# Altium schematic sheet LED.SchDoc
size A4; SheetNumber: 1; SheetTotal: 1
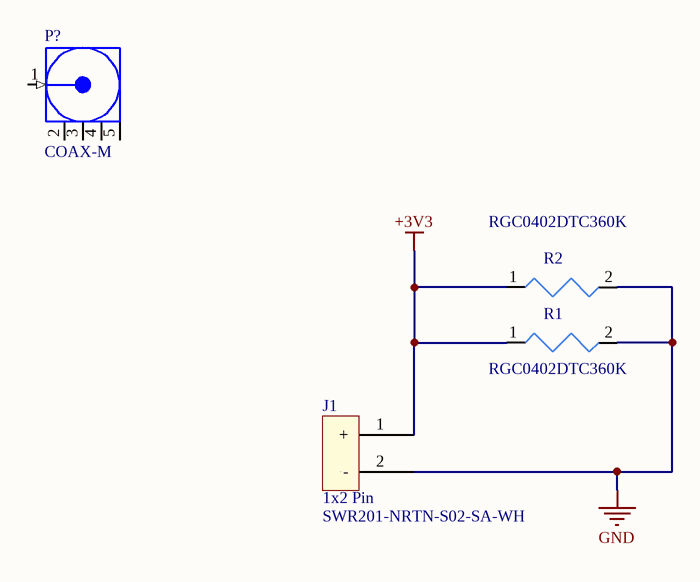
[diagram p0: LED.SchDoc]

## Parts
J1  1x2 Pin  [DIP1x2]
P?  COAX-M  [MMCX2.54-V5]
R1  (no value)  [R0805]
R2  (no value)  [R0805]

## Nets
+3V3: J1.1(+) R1.1 R2.1
GND: J1.2(-) R1.2 R2.2

Not connected (* = marked no-connect by the designer): P? 1(Signal) 2(GND) 3(GND) 4(GND) 5(GND)

## Library data of the parts
J1 = SWR201-NRTN-S02-SA-WH: Wafer: , Tin Overall, Straight w/ Type 1 Kinked End Pins, 1x2 Pos (2 pins); Manufacturer: Sullins; Supplier 1: Digi-Key; Supplier Part Number 1: S9463-ND; RoHS: Yes; Category: Connectors; Stock 1: 156546; Pricing 1: 1=0.11000, 10=0.08500, 100=0.06260, 500=0.05184, 1000=0.04536, 5000=0.03888, 10000=0.03780 (USD); ComponentLink1URL: https://datasheet.ciiva.com/740/swr201-nrtn-sxx-sa-wh-740670.pdf?src-supplier=Digi-Key; ComponentLink1Description: https://datasheet.ciiva.com/740/swr201-nrtn-sxx-sa-wh-740670.pdf?src-supplier=Digi-Key; ComponentLink2URL: https://datasheet.ciiva.com/16492/swr201-nrtn-sa-wh-16492311.pdf?src-supplier=Future+Electronics; ComponentLink2Description: https://datasheet.ciiva.com/16492/swr201-nrtn-sa-wh-16492311.pdf?src-supplier=Future+Electronics; Manufacturer Part Number: SWR201-NRTN-S02-SA-WH
P? = COAX-M: RF Coaxial PCB Connector, MMCX; Thru-Hole, Vertical Mount Plug,  50 Ohm Impedance; PackageDocument: Rev. A, 16-Jun-1997; PCB_Layout: Complies with manufacturer's recommendation.; DrillSize: Corresponds to nominal value.; Published: 15-Jul-2004; LatestRevisionDate: 15-Jul-2004; LatestRevisionNote: Component Replaced.; DatasheetDocument: 30-May-2003; PackageReference: 908-21103; Publisher: Altium Limited; ComponentLink1Description: Manufacturer Link; ComponentLink1URL: http://www.amphenolrf.com/
R1 R2 = RGC0402DTC360K: Res Thkflm 0402 360K Ohm 0.5% 1/16W 50PPM/ C SMD; Manufacturer: Stackpole Electronics; Power Rating: 63mW; Resistance: 360000R; Supplier 1: Digi-Key; Supplier Part Number 1: RGC0402DTC360KCT-ND; RoHS: Yes; Category: Chip SMD Resistors; Stock 1: 3216; Pricing 1: 1=0.13000, 10=0.12100, 100=0.04640, 1000=0.02039, 2500=0.01761, 5000=0.01576 (USD); Mount: Surface Mount; Case/Package: 0402; Min Operating Temperature: -55°C; Max Operating Temperature: 150°C; Packaging: Tape and Reel; Tolerance: 0.5%; Lead Free: Lead Free; ComponentLink1URL: https://www.seielect.com/catalog/sei-rgc.pdf?src-supplier=Digi-Key; ComponentLink1Description: https://www.seielect.com/catalog/sei-rgc.pdf?src-supplier=Digi-Key; Manufacturer Part Number: RGC0402DTC360K